# EAGLE design daughter_v1 (EAGLE 9.6.2)
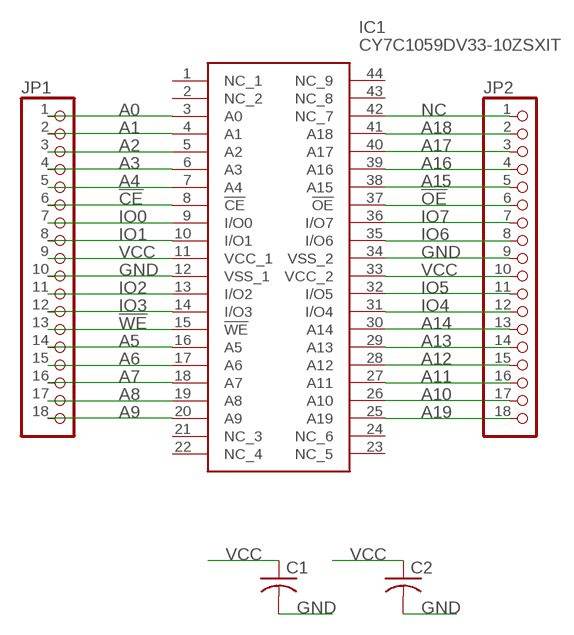
[diagram p0: schematic, sheet 1]

## Parts
C1  C-USC0805  [C0805]
C2  C-USC0805  [C0805]
IC1  CY7C1059DV33-10ZSXIT  [SOP80P1184X119-44N]
JP1  PINHD-1X18  [1X18]
JP2  PINHD-1X18  [1X18]

## Nets
!CE: IC1.8(!CE) JP1.6
!OE: IC1.37(!OE) JP2.6
!WE: IC1.15(!WE) JP1.13
A0: IC1.3(A0) JP1.1
A1: IC1.4(A1) JP1.2
A2: IC1.5(A2) JP1.3
A3: IC1.6(A3) JP1.4
A4: IC1.7(A4) JP1.5
A5: IC1.16(A5) JP1.14
A6: IC1.17(A6) JP1.15
A7: IC1.18(A7) JP1.16
A8: IC1.19(A8) JP1.17
A9: IC1.20(A9) JP1.18
A10: IC1.26(A10) JP2.17
A11: IC1.27(A11) JP2.16
A12: IC1.28(A12) JP2.15
A13: IC1.29(A13) JP2.14
A14: IC1.30(A14) JP2.13
A15: IC1.38(A15) JP2.5
A16: IC1.39(A16) JP2.4
A17: IC1.40(A17) JP2.3
A18: IC1.41(A18) JP2.2
A19: IC1.25(A19) JP2.18
GND: C1.2 C2.2 IC1.12(VSS_1) IC1.34(VSS_2) JP1.10 JP2.9
IO0: IC1.9(I/O0) JP1.7
IO1: IC1.10(I/O1) JP1.8
IO2: IC1.13(I/O2) JP1.11
IO3: IC1.14(I/O3) JP1.12
IO4: IC1.31(I/O4) JP2.12
IO5: IC1.32(I/O5) JP2.11
IO6: IC1.35(I/O6) JP2.8
IO7: IC1.36(I/O7) JP2.7
NC: IC1.42(NC_7) JP2.1
VCC: C1.1 C2.1 IC1.11(VCC_1) IC1.33(VCC_2) JP1.9 JP2.10
Unconnected: IC1.1(NC_1) IC1.2(NC_2) IC1.21(NC_3) IC1.22(NC_4) IC1.23(NC_5) IC1.24(NC_6) IC1.43(NC_8) IC1.44(NC_9)

## Library data of the parts
C1 C2 = rcl:C-US: CAPACITOR, American symbol; SPICEPREFIX: C
IC1 = SamacSys_Parts:CY7C1059DV33-10ZSXIT: SRAM 8MB (1Mx8) 3.3v 10ns Fast Async SRAM Source: Datasheet <https://componentsearchengine.com/Datasheets/1/CY7C1059DV33-10ZSXIT.pdf>; ARROW_PART_NUMBER: CY7C1059DV33-10ZSXIT; ARROW_PRICE-STOCK: https://www.arrow.com/en/products/cy7c1059dv33-10zsxit/cypress-semiconductor?region=nac; DESCRIPTION: SRAM 8MB (1Mx8) 3.3v 10ns Fast Async SRAM; HEIGHT: 1.194mm; MANUFACTURER_NAME: Cypress Semiconductor; MANUFACTURER_PART_NUMBER: CY7C1059DV33-10ZSXIT; MOUSER_PART_NUMBER: 727-C1059DV3310ZSXIT; MOUSER_PRICE-STOCK: https://www.mouser.co.uk/ProductDetail/Cypress-Semiconductor/CY7C1059DV33-10ZSXIT?qs=k2piNBSag38I1iaL2AXkLQ%3D%3D
JP1 JP2 = pinhead:PINHD-1X18: PIN HEADER

## Board
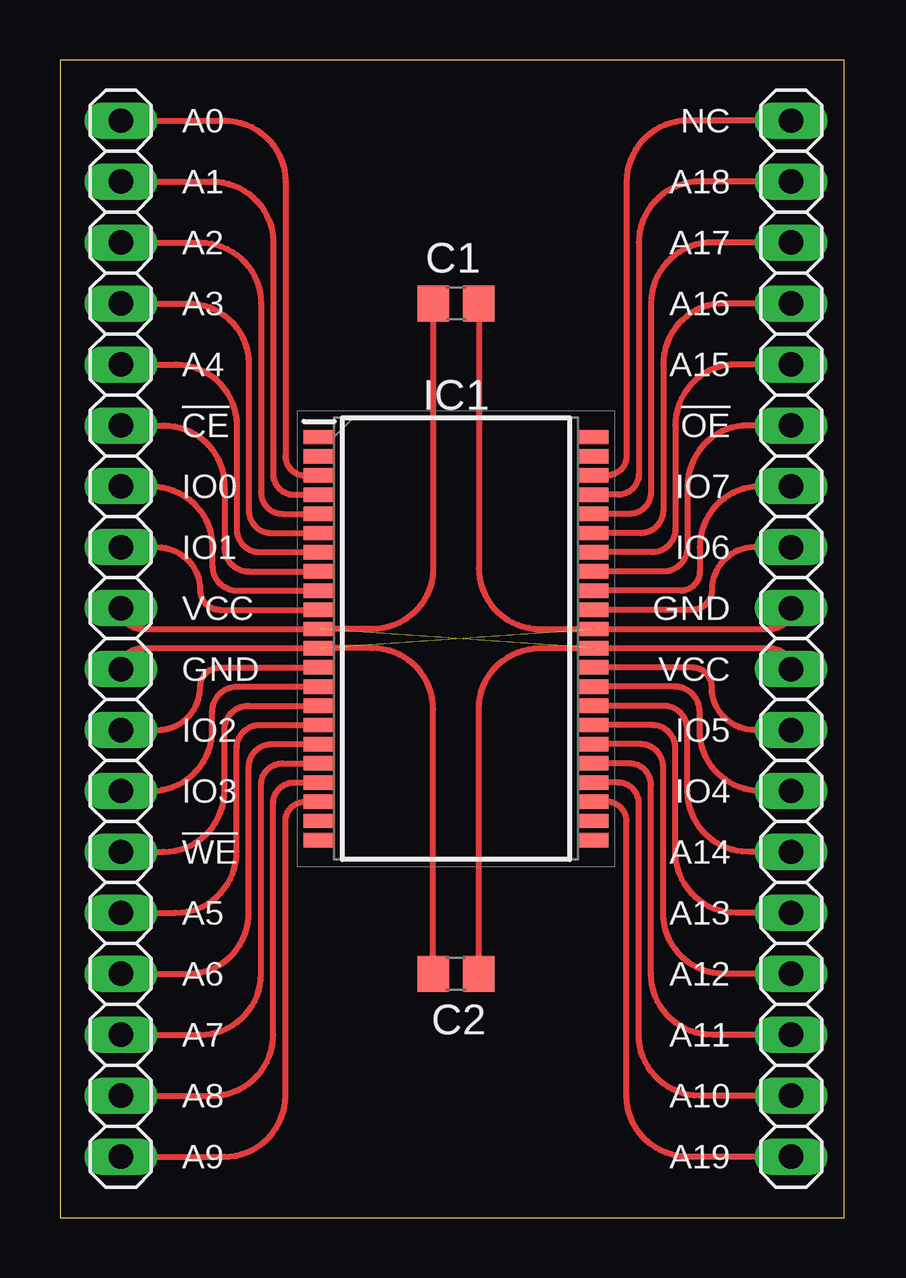
[diagram p1: board, top side]
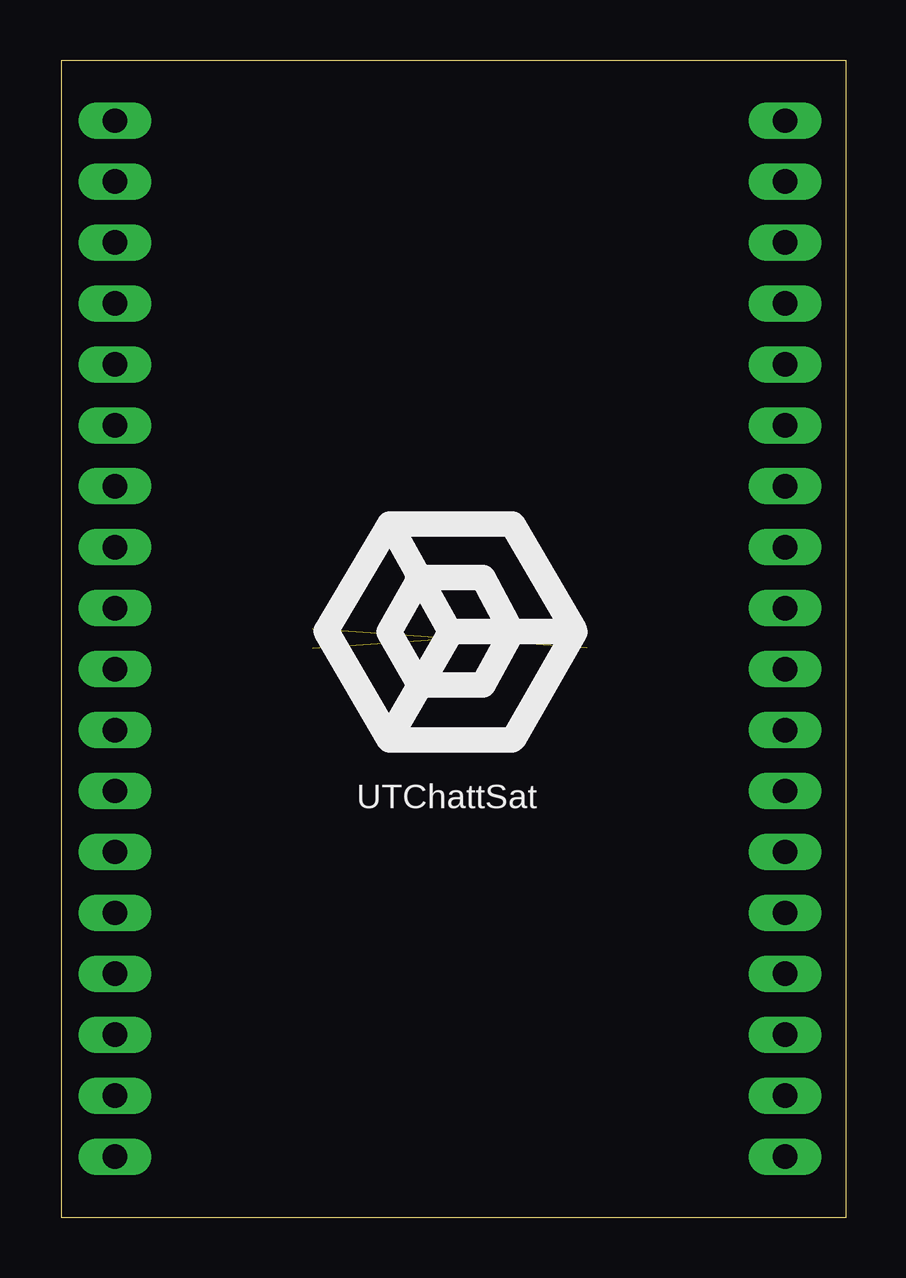
[diagram p2: board, bottom side, seen from below]

Size 32.69 x 48.25 mm. Coordinates in mm from the lower left corner, seen from the top.
Outline: 0,0 32.69,0 32.69,48.25 0,48.25 0,0
Copper layers (1*16): Top 0.035mm / dielectric 0.2mm / Bottom 0.035mm
Design rules "jlcpcb-2-layer *": minimum track width 3.5mil, minimum drill 0.2mm, track to track 3.5mil, track to pad 10mil, pad to pad 5mil, via to via 5mil, smd to smd 0mil, copper to edge 0.1mm, drill to drill 5mil, minimum pad ring 4mil, minimum via ring 4mil, stop-mask expansion 3mil, vias tented up to drill 100mil, thermal gap 10mil

### Footprints (pad centres in the part's own frame; a part is rotated, then mirrored left to right if it is on the bottom)
C0805 = smd 1.3 x 1.5: 1 -0.95,0; 2 0.95,0
SOP80P1184X119-44N = smd 1.27 x 0.6: 1 -5.715,8.4; 2 -5.715,7.6; 3 -5.715,6.8; 4 -5.715,6; 5 -5.715,5.2; 6 -5.715,4.4; 7 -5.715,3.6; 8 -5.715,2.8; 9 -5.715,2; 10 -5.715,1.2; 11 -5.715,0.4; 12 -5.715,-0.4; 13 -5.715,-1.2; 14 -5.715,-2; 15 -5.715,-2.8; 16 -5.715,-3.6; 17 -5.715,-4.4; 18 -5.715,-5.2; 19 -5.715,-6; 20 -5.715,-6.8; 21 -5.715,-7.6; 22 -5.715,-8.4; 23 5.715,-8.4; 24 5.715,-7.6; 25 5.715,-6.8; 26 5.715,-6; 27 5.715,-5.2; 28 5.715,-4.4; 29 5.715,-3.6; 30 5.715,-2.8; 31 5.715,-2; 32 5.715,-1.2; 33 5.715,-0.4; 34 5.715,0.4; 35 5.715,1.2; 36 5.715,2; 37 5.715,2.8; 38 5.715,3.6; 39 5.715,4.4; 40 5.715,5.2; 41 5.715,6; 42 5.715,6.8; 43 5.715,7.6; 44 5.715,8.4
1X18 = drill 1.016 long: 1 -21.59,0; 2 -19.05,0; 3 -16.51,0; 4 -13.97,0; 5 -11.43,0; 6 -8.89,0; 7 -6.35,0; 8 -3.81,0; 9 -1.27,0; 10 1.27,0; 11 3.81,0; 12 6.35,0; 13 8.89,0; 14 11.43,0; 15 13.97,0; 16 16.51,0; 17 19.05,0; 18 21.59,0

### Placement (x,y rotation side)
C1  16.51,38.1 0 top
C2  16.51,10.16 180 top
IC1  16.51,24.13 0 top
JP1  2.54,24.13 270 top
JP2  30.48,24.13 270 top

### Tracks (layer width: path | path; a pad name or v marks a point on that pad's centre or on a via)
!CE
  Top 0.254: JP1.6 4.32,33.02 arc-90 6.86,30.48 6.86,27.94 arc90 7.87,26.93 IC1.8
!OE
  Top 0.254: JP2.6 28.7,33.02 arc90 26.16,30.48 26.16,27.94 arc-90 25.15,26.93 IC1.37
!WE
  Top 0.254: JP1.13 4.32,15.24 arc90 6.86,17.78 6.86,20.32 arc-90 7.87,21.33 IC1.15
A0
  Top 0.254: JP1.1 6.86,45.72 arc-90 9.4,43.18 9.4,31.75 arc90 10.22,30.93 IC1.3
A1
  Top 0.254: JP1.2 6.35,43.18 arc-90 8.89,40.64 8.89,30.99 arc90 9.75,30.13 IC1.4
A2
  Top 0.254: JP1.3 5.84,40.64 arc-90 8.38,38.1 8.38,30.23 arc90 9.28,29.33 IC1.5
A3
  Top 0.254: JP1.4 5.33,38.1 arc-90 7.87,35.56 7.87,29.46 arc90 8.81,28.53 IC1.6
A4
  Top 0.254: JP1.5 4.83,35.56 arc-90 7.37,33.02 7.37,28.7 arc90 8.34,27.73 IC1.7
A5
  Top 0.254: JP1.14 4.83,12.7 arc90 7.37,15.24 7.37,19.56 arc-90 8.34,20.53 IC1.16
A6
  Top 0.254: JP1.15 5.33,10.16 arc90 7.87,12.7 7.87,18.8 arc-90 8.81,19.73 IC1.17
A7
  Top 0.254: JP1.16 5.84,7.62 arc90 8.38,10.16 8.38,18.03 arc-90 9.28,18.93 IC1.18
A8
  Top 0.254: JP1.17 6.35,5.08 arc90 8.89,7.62 8.89,17.27 arc-90 9.75,18.13 IC1.19
A9
  Top 0.254: JP1.18 6.86,2.54 arc90 9.4,5.08 9.4,16.51 arc-90 10.22,17.33 IC1.20
A10
  Top 0.254: JP2.17 26.67,5.08 arc-90 24.13,7.62 24.13,17.27 arc90 23.27,18.13 IC1.26
A11
  Top 0.254: JP2.16 27.18,7.62 arc-90 24.64,10.16 24.64,18.03 arc90 23.74,18.93 IC1.27
A12
  Top 0.254: JP2.15 27.69,10.16 arc-90 25.15,12.7 25.15,18.8 arc90 24.21,19.73 IC1.28
A13
  Top 0.254: JP2.14 28.19,12.7 arc-90 25.65,15.24 25.65,19.56 arc90 24.68,20.53 IC1.29
A14
  Top 0.254: JP2.13 28.7,15.24 arc-90 26.16,17.78 26.16,20.32 arc90 25.15,21.33 IC1.30
A15
  Top 0.254: JP2.5 28.19,35.56 arc90 25.65,33.02 25.65,28.7 arc-90 24.68,27.73 IC1.38
A16
  Top 0.254: JP2.4 27.69,38.1 arc90 25.15,35.56 25.15,29.46 arc-90 24.21,28.53 IC1.39
A17
  Top 0.254: JP2.3 27.18,40.64 arc90 24.64,38.1 24.64,30.23 arc-90 23.74,29.33 IC1.40
A18
  Top 0.254: JP2.2 26.67,43.18 arc90 24.13,40.64 24.13,30.99 arc-90 23.27,30.13 IC1.41
A19
  Top 0.254: JP2.18 26.16,2.54 arc-90 23.62,5.08 23.62,16.51 arc90 22.8,17.33 IC1.25
GND  (1 unrouted)
  Top 0.254: JP1.10 arc-90 3.41,23.73 IC1.12 13.02,23.73 arc-90 15.56,21.19 C2.2 | JP2.9 arc-90 29.61,24.53 IC1.34 20,24.53 arc-90 17.46,27.07 C1.2
IO0
  Top 0.254: JP1.7 3.81,30.48 arc-90 6.35,27.94 6.35,27.18 arc90 7.4,26.13 IC1.9
IO1
  Top 0.254: JP1.8 4.06,27.94 arc-90 5.84,26.16 arc90 6.67,25.33 IC1.10
IO2
  Top 0.254: JP1.11 4.06,20.32 arc90 5.84,22.1 arc-90 6.67,22.93 IC1.13
IO3
  Top 0.254: JP1.12 3.81,17.78 arc90 6.35,20.32 6.35,21.08 arc-90 7.4,22.13 IC1.14
IO4
  Top 0.254: JP2.12 29.21,17.78 arc-90 26.67,20.32 26.67,21.08 arc90 25.62,22.13 IC1.31
IO5
  Top 0.254: JP2.11 28.96,20.32 arc-90 27.18,22.1 arc90 26.35,22.93 IC1.32
IO6
  Top 0.254: JP2.8 28.96,27.94 arc90 27.18,26.16 arc-90 26.35,25.33 IC1.35
IO7
  Top 0.254: JP2.7 29.21,30.48 arc90 26.67,27.94 26.67,26.92 arc-90 25.88,26.13 IC1.36
NC
  Top 0.254: JP2.1 26.16,45.72 arc90 23.62,43.18 23.62,31.75 arc-90 22.8,30.93 IC1.42
VCC  (1 unrouted)
  Top 0.254: JP1.9 arc90 3.41,24.53 IC1.11 13.02,24.53 arc90 15.56,27.07 C1.1 | JP2.10 arc90 29.61,23.73 IC1.33 20,23.73 arc90 17.46,21.19 C2.1

### Text on the board
tPlace: A0 | NC | A1 | A18 | A2 | A17 | A3 | A16 | A4 | A15 | !CE | !OE | IO0 | IO7 | IO1 | IO6 | VCC | GND | GND | VCC | IO2 | IO5 | IO3 | IO4 | !WE | A14 | A5 | A13 | A6 | A12 | A7 | A11 | A8 | A10 | A9 | A19
bPlace: UTChattSat